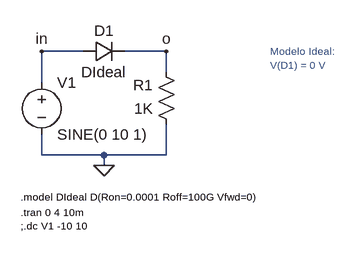
[diagram p0: schematic rectificador-media-onda_ideal.asc]
rectificador-media-onda_ideal.asc, the LTspice schematic file:
Version 4
SHEET 1 1376 680
WIRE 80 48 16 48
WIRE 208 48 144 48
WIRE 208 80 208 48
WIRE 16 96 16 48
WIRE 16 208 16 176
WIRE 112 208 16 208
WIRE 208 208 208 160
WIRE 208 208 112 208
WIRE 112 224 112 208
FLAG 112 224 0
FLAG 208 48 o
FLAG 16 48 in
SYMBOL diode 80 64 R270
WINDOW 0 32 32 VTop 2
WINDOW 3 0 32 VBottom 2
SYMATTR InstName D1
SYMATTR Value DIdeal
SYMBOL voltage 16 80 R0
WINDOW 123 0 0 Left 0
WINDOW 39 0 0 Left 0
SYMATTR InstName V1
SYMATTR Value SINE(0 10 1)
SYMBOL res 224 176 R180
WINDOW 0 36 76 Left 2
WINDOW 3 36 40 Left 2
SYMATTR InstName R1
SYMATTR Value 1K
TEXT -16 296 Left 1 !.tran 0 4 10m\n;.dc V1 -10 10
TEXT -16 272 Left 1 !.model DIdeal D(Ron=0.0001 Roff=100G Vfwd=0)
TEXT 368 48 Left 1 ;Modelo Ideal:\nV(D1) = 0 V

The netlist it stands for:
* rectificador-media-onda_ideal.asc
D1 in o DIdeal
V1 in 0 SINE(0 10 1)
R1 0 o 1K
.model D D
.lib standard.dio
.tran 0 4 10m
;.dc V1 -10 10
.model DIdeal D(Ron=0.0001 Roff=100G Vfwd=0)
* Modelo Ideal:
* V(D1) = 0 V
.backanno
.end